# EAGLE design pthbadge_batt_non_sao (EAGLE 9.0.1)
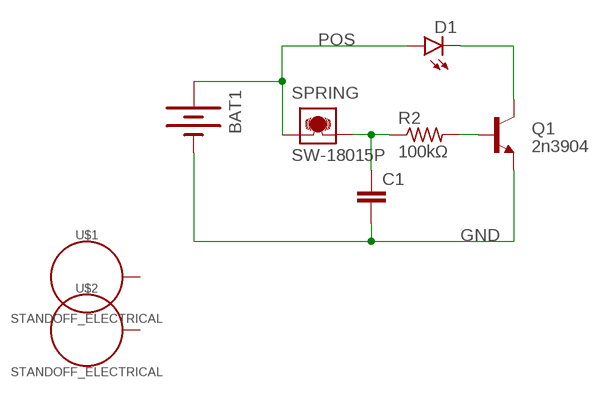
[diagram p0: schematic, sheet 1]

## Parts
BAT1  BATTERY20PTH  [BATTCOM_20MM_PTH]
C1  CAPPTH  [CAP-PTH-SMALL]
D1  LED5MM  [LED5MM]
Q1  2n3904  TRANSISTOR_NPN2N3904  [TO-92]
R2  100kΩ  R-US_0207/10  [0207/10]
SPRING  SW-18015P  [SW-18015P]
U$1  STANDOFF_ELECTRICAL  [STANDOFF-ELECTRICAL]
U$2  STANDOFF_ELECTRICAL  [STANDOFF-ELECTRICAL]

## Nets
BASE: Q1.2(B) R2.2
GND: BAT1.2(-) C1.2 Q1.1(E)
N$4: D1.K(C) Q1.3(C)
N$6: C1.1 R2.1 SPRING.2
POS: BAT1.1(+) D1.A SPRING.1
Unconnected: U$1.P1 U$2.P1

## Library data of the parts
BAT1 = SparkFun-Electromechanical:BATTERY: Battery Holders Various common sizes : AA, AAA, 18650 (PRT-12895), 20mm coin cell and 12mm coin cell. 20MM_4LEGS, BATT-10373
C1 = SparkFun-Capacitors:CAP: Capacitor Standard 0603 ceramic capacitor, and 0.1" leaded capacitor.
D1 = SparkFun-LED:LED: LEDs Standard schematic elements and footprints for 5mm, 3mm, 1206, and 0603 sized LEDs. 5mm - Spark Fun Electronics SKU : COM-00529 (and others)
Q1 = SparkFun-DiscreteSemi:TRANSISTOR_NPN: Generic NPN BJT MMBT2222A - TRANS-08049 (SOT-23, 1A 40V) MPSA42 - TRANS-09116 (SOT-23, 500mA 300V) MMBT5088LT1G - TRANS-11160 (SOT-23, 50 mA 30V) BC547 - COM-08928 <http://www.sparkfun.com/products/8928> (TO-92 45V 100mA) (1.Collector 2.Base 3.Emitter) 2N3904 - COM-00521 <http://www.sparkfun.com/products/521> (TO-92 40V 200mA) (1.Emitter 2.Base 3.Collector) P2N2222A - COM-12852 <http://www.sparkfun.com/products/12852> (TO-92 40V 600mA) (1.Collector 2.Base 3.Emitter); PROD_ID: TRANS-08447
R2 = adafruit:R-US_: RESISTOR, American symbol
SPRING = lio:SW-18015P: MOVEMENT / VIBRATION SWITCH; MF: FARNELL; MPN: CM4400-1.; OC_FARNELL: 540626; OC_NEWARK: 09WX7014
U$1 U$2 = SparkFun-Hardware:STANDOFF_ELECTRICAL: Stand Off Drill holes with an electrical connection. For example, use these to ground your board to a chassis. Example SparkFun Products Screw - Phillips Head (1/4", 4-40, 10 pack) <https://www.sparkfun.com/products/10453> (PRT-10453) Screw - Phillips Head (1/2", 4-40, 10 pack) <https://www.sparkfun.com/products/10452> (PRT-10452) Screw - Phillips Head (3/4", 4-40, 10 pack) <https://www.sparkfun.com/products/10451> (PRT-10451) Screw - Phillips Head (1", 4-40, 10 pack) <https://www.sparkfun.com/products/10450> (PRT-10450)

## Board
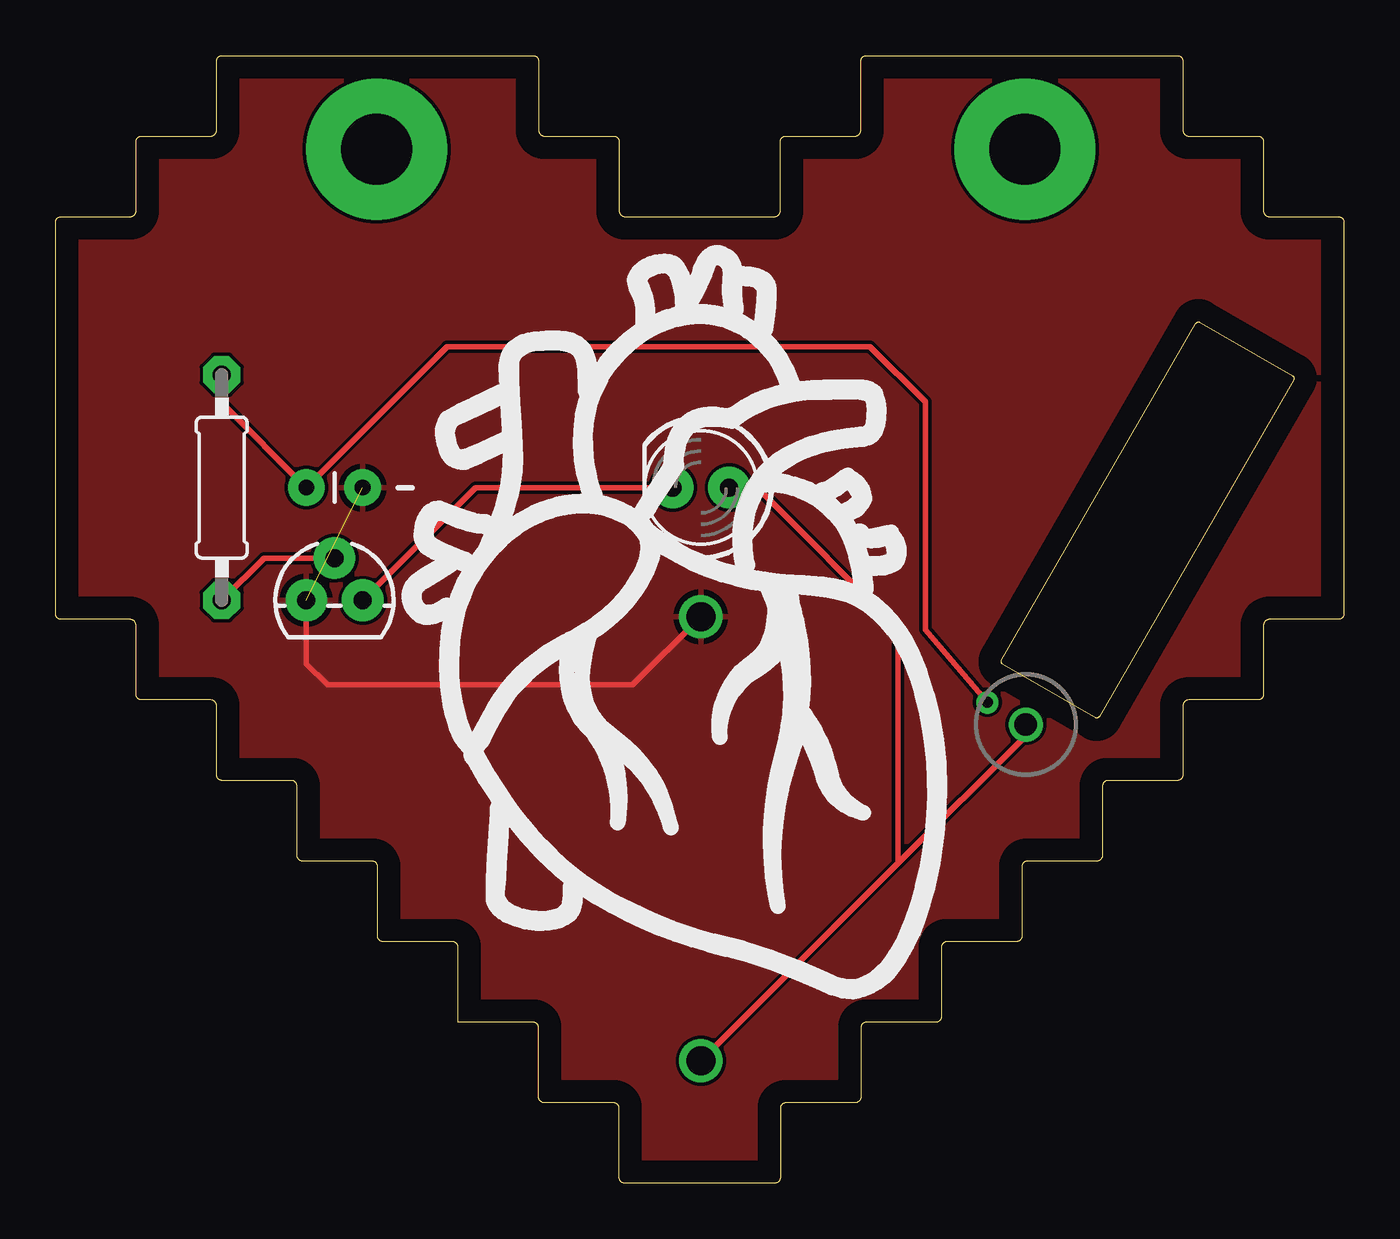
[diagram p1: board, top side]
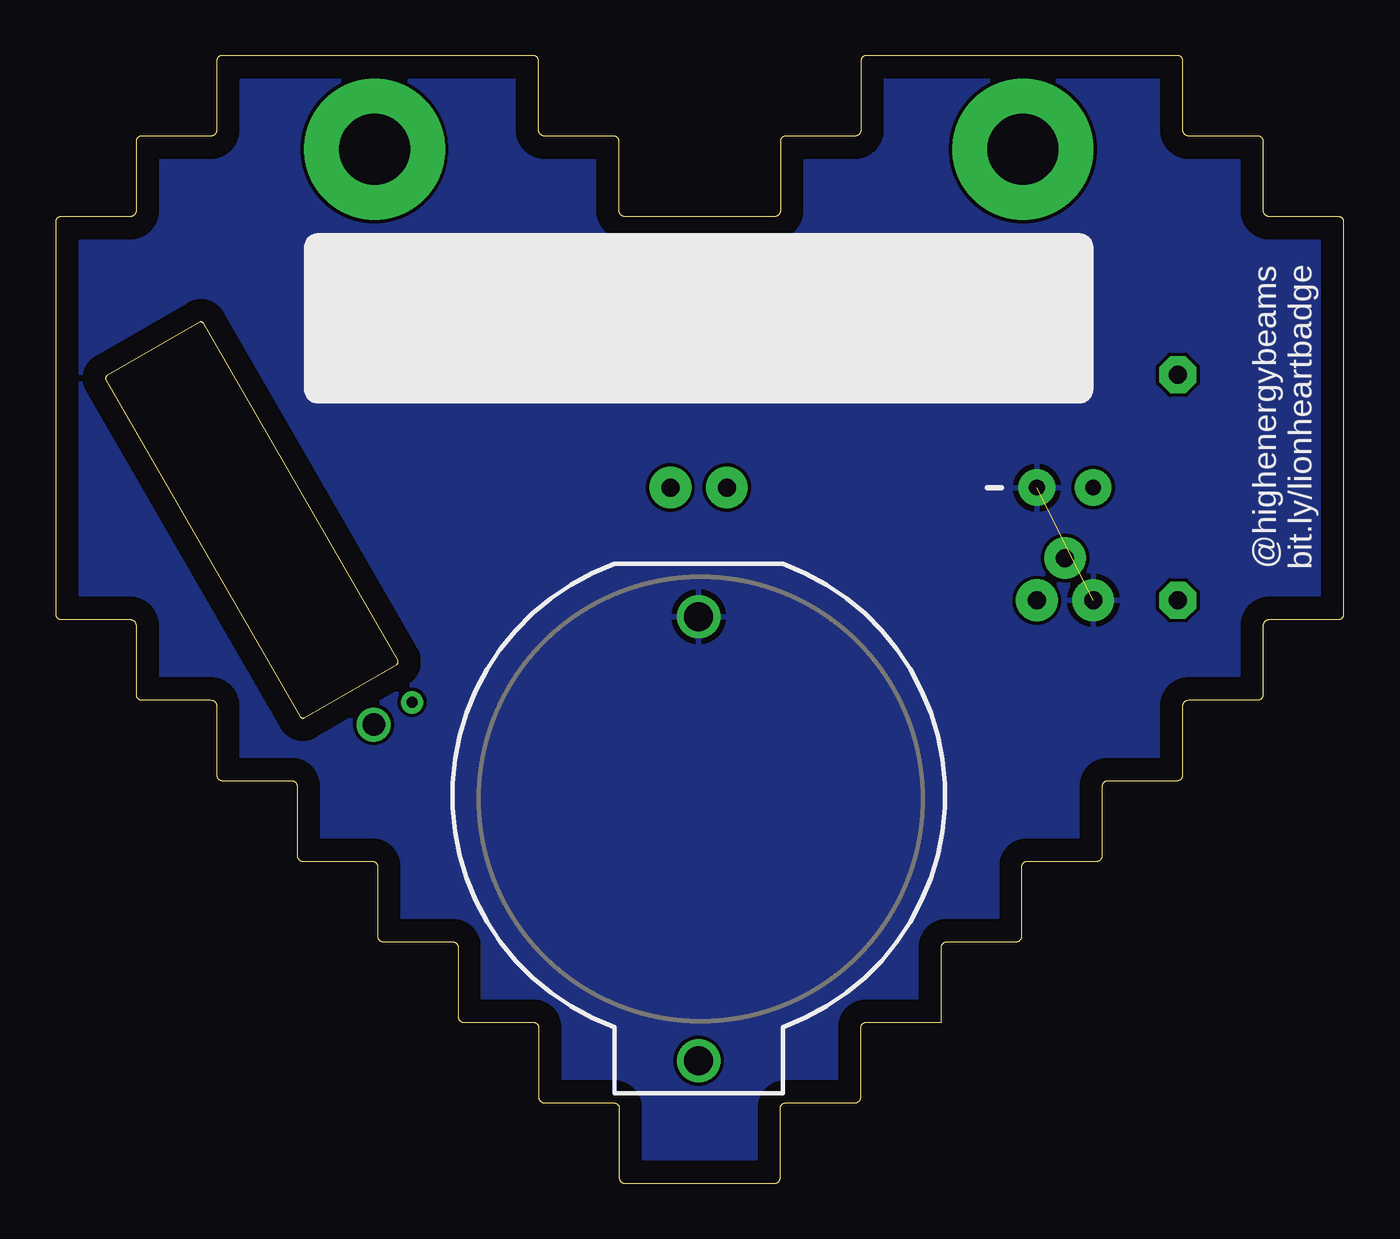
[diagram p2: board, bottom side, seen from below]

Size 58.06 x 50.8 mm. Coordinates in mm from the lower left corner, seen from the top.
Outline: 7.26,47.43 7.26,50.55 arc-90 7.51,50.8 21.52,50.8 arc-90 21.77,50.55 21.77,47.43 arc90 22.03,47.17 25.15,47.17 arc-90 25.4,46.92 25.4,43.8 arc90 25.65,43.54 32.4,43.54 arc90 32.66,43.8 32.66,46.92 arc-90 32.91,47.17 36.03,47.17 arc90 36.29,47.43 36.29,50.55 arc-90 36.54,50.8 50.55,50.8 arc-90 50.8,50.55 50.8,47.43 arc90 51.05,47.17 54.17,47.17 arc-90 54.43,46.92 54.43,43.8 arc90 54.68,43.54 57.8,43.54 arc-90 58.06,43.29 58.06,25.65 arc-90 57.8,25.4 54.68,25.4 arc90 54.43,25.15 54.43,22.03 arc-90 54.17,21.77 51.05,21.77 arc90 50.8,21.52 50.8,18.4 arc-90 50.55,18.14 47.43,18.14 arc90 47.17,17.89 47.17,14.77 arc-90 46.92,14.51 43.8,14.51 arc90 43.54,14.26 43.54,11.14 arc-90 43.29,10.89 40.17,10.89 arc90 39.91,10.63 39.91,7.51 arc-90 39.66,7.26 36.54,7.26 arc90 36.29,7 36.29,3.88 arc-90 36.03,3.63 32.91,3.63 arc90 32.66,3.37 32.66,0.25 arc-90 32.4,0 25.65,0 arc-90 25.4,0.25 25.4,3.37 arc90 25.15,3.63 22.03,3.63 arc-90 21.77,3.88 21.77,7 arc90 21.52,7.26 18.14,7.26 18.14,10.63 arc90 17.89,10.89 14.77,10.89 arc-90 14.51,11.14 14.51,14.26 arc90 14.26,14.51 11.14,14.51 arc-90 10.89,14.77 10.89,17.89 arc90 10.63,18.14 7.51,18.14 arc-90 7.26,18.4 7.26,21.52 arc90 7,21.77 3.88,21.77 arc-90 3.63,22.03 3.63,25.15 arc90 3.38,25.4 0.25,25.4 arc-90 0,25.65 0,43.29 arc-90 0.25,43.54 3.38,43.54 arc90 3.63,43.8 3.63,46.92 arc-90 3.88,47.17 7,47.17 arc90 7.26,47.43
Outline: 55.79,36.2 47.03,21.02 arc-90 46.85,20.97 42.67,23.39 arc-90 42.63,23.56 51.39,38.74 arc-90 51.56,38.78 55.74,36.37 arc-90 55.79,36.2
Copper layers (1*16): Top 0.035mm / dielectric 1.5mm / Bottom 0.035mm
Design rules "default": minimum track width 6mil, minimum drill 0.35mm, track to track 6mil, track to pad 6mil, pad to pad 6mil, via to via 6mil, smd to smd 6mil, copper to edge 40mil, drill to drill 6mil, minimum pad ring 10mil, minimum via ring 8mil, stop-mask expansion 4mil, vias tented up to drill 0mil, thermal gap 10mil

### Footprints (pad centres in the part's own frame; a part is rotated, then mirrored left to right if it is on the bottom)
BATTCOM_20MM_PTH = drill 1.3: 1 11.85,0; 2 -8.15,0
CAP-PTH-SMALL = drill 0.7 pad 1.651: 1 0,0; 2 2.54,0
LED5MM = drill 0.813 pad 1.88: A -1.27,0; K 1.27,0
TO-92 = drill 0.813 pad 1.88: 1 -1.27,0; 2 0,1.905; 3 1.27,0
0207/10 = drill 0.813 pad 1.676 octagon: 1 -5.08,0; 2 5.08,0
SW-18015P = drill 1.016: 1 0,0 | drill 0.5: 2 0,-2
STANDOFF-ELECTRICAL = drill 3.2 pad 6.35: P1 0,0

### Placement (x,y rotation side)
BAT1  29.08,17.37 270 bottom
C1  11.3,31.34 0 top
D1  29.08,31.34 180 top
Q1  12.57,26.26 0 top
R2  7.49,31.34 270 top
SPRING  43.72,20.66 240 top
U$1  14.47,46.58 0 top
U$2  43.68,46.58 0 top

### Tracks (layer width: path | path; a pad name or v marks a point on that pad's centre or on a via)
BASE
  Top 0.254: Q1.2 9.39,28.16 R2.2
GND  (1 unrouted)
  Top 0.254: BAT1.2 26.01,22.45 12.25,22.45 11.3,23.4 Q1.1
  pour Top: -6.48,55.47 -6.48,-5.49 69.72,-5.49 69.72,55.47
  pour Bottom: -3.94,52.93 -3.94,-5.49 59.56,-5.49 59.56,52.93
N$4
  Top 0.254: Q1.3 18.92,31.34 D1.K
N$6
  Top 0.254: SPRING.2 39.19,24.94 39.19,35.2 36.7,37.69 17.65,37.69 C1.1 7.49,35.15 R2.1
POS
  Top 0.254: 37.97,14.41 37.97,24.99 31.62,31.34 D1.A | BAT1.1 37.97,14.41 | 37.97,14.41 43.72,20.16 SPRING.1

### Text on the board
bNames: @highenergybeams / bit.ly/lionheartbadge